# Altium project wificar.PrjPcb
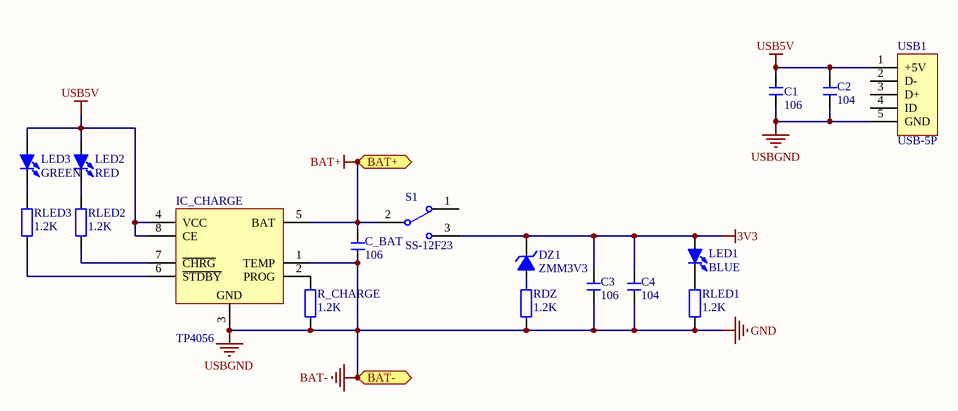
[diagram p0: Charge.SchDoc]
4 sheets, 33 parts. Net scope: flat (ports and power ports of the same name join across sheets).
Board file: SMARTWIFICAR.PcbDoc
Sheets:
  Charge.SchDoc
  Control.SchDoc
  Motor.SchDoc
  IO_CONN.SchDoc

## Sheet Charge.SchDoc
size A4

### Parts
C1  106  [C 0805_L]
C2  104  [C 0805_L]
C3  106  [C 0805_L]
C4  104  [C 0805_L]
C_BAT  106  [C 0805_L]
DZ1  ZMM3V3  [MINI_MELF (LL34)]
IC_CHARGE  TP4056  [SOP8_N]
LED1  BLUE  [LED 0805B]
LED2  RED  [LED 0805R]
LED3  GREEN  [LED 0805G]
R_CHARGE  1.2K  [R 0805_L]
RDZ  1.2K  [R 0805_L]
RLED1  1.2K  [R 0805_L]
RLED2  1.2K  [R 0805_L]
RLED3  1.2K  [R 0805_L]
S1  SS-12F23  [MSK-12C01-07]
USB1  USB-5P  [USB-MICRO_B]

### Ports
BAT+ (bidir), BAT- (bidir)

### Nets
3V3: C3.2 C4.2 DZ1.2(K) LED1.1(A) S1.3
BAT+: C_BAT.2 IC_CHARGE.5(BAT) S1.2 ; port BAT+
BAT-: C1.1 C2.1 C3.1 C4.1 C_BAT.1 IC_CHARGE.1(TEMP) IC_CHARGE.3(GND) R_CHARGE.1 RDZ.1 RLED1.1 USB1.5(GND) ; port BAT-  [also labelled GND, USBGND]
USB5V: C1.2 C2.2 IC_CHARGE.4(VCC) IC_CHARGE.8(CE) LED2.1(A) LED3.1(A) USB1.1(+5V)
NetDZ1_1: DZ1.1(A) RDZ.2
NetIC_CHARGE_2: IC_CHARGE.2(PROG) R_CHARGE.2
NetIC_CHARGE_6: IC_CHARGE.6(~{STDBY}) RLED3.1
NetIC_CHARGE_7: IC_CHARGE.7(~{CHRG}) RLED2.1
NetLED1_2: LED1.2(K) RLED1.2
NetLED2_2: LED2.2(K) RLED2.2
NetLED3_2: LED3.2(K) RLED3.2

Not connected (* = marked no-connect by the designer): S1 1; USB1 2(D-) 3(D+) 4(ID)

### Library data of the parts
C1-C4 C_BAT = C: 贴片电容; BOM名称: 无极性贴片电容; 淘宝ID: 封装库来自淘宝 ID：黄晶宝石; 联系售后，技术支持: https://shop463601444.taobao.com; 唯一出售店铺网址: https://shop463601444.taobao.com
DZ1 = 1N4619: 3V/0.5W稳压管; 版权归属: 封装库来自淘宝 ID：黄晶宝石; BOM名称: 3V/0.5W稳压管; 学习资源: www.ooocke.com
IC_CHARGE = TP4056: 锂电池充电管理; 淘宝ID: 封装库来自淘宝 ID：黄晶宝石; BOM名称: 锂电池充电管理; 技术支持，联系售后: https://shop463601444.taobao.com; 唯一出售店铺网址: https://shop463601444.taobao.com
LED1-LED3 = LED-SMD: 贴片LED; 版权归属: 封装库来自淘宝 ID：黄晶宝石; BOM名称: 贴片LED; 学习资源: https://shop463601444.taobao.com
R_CHARGE RDZ RLED1-RLED3 = R: 贴片电阻; 版权归属: 来自淘宝 ID：黄晶宝石; 封装库来自淘宝卖家 ID：黄晶宝石: 其他店铺购入均为盗版，不享受售后技术支持服务，请立即申请退款; BOM名称: 贴片电阻; 联系售后: https://shop463601444.taobao.com
S1 = SSW-1P: 1路波动开关; BOM名称: 波动开关; 版权归属: 封装库来自淘宝 ID：黄晶宝石; 学习资源: https://shop463601444.taobao.com
USB1 = USB-5P: 微型USB母座; BOM名称: 微型USB母座; 学习资源: https://shop463601444.taobao.com

## Sheet Control.SchDoc
size A4
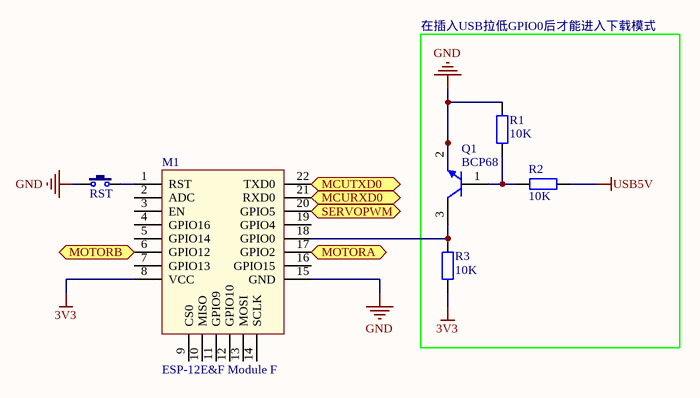
[diagram p1: Control.SchDoc]

### Parts
M1  ESP-12E&F Module F  [ESP-12E&F Module]
Q1  BCP68  [SOT-23]
R1  10K  [R 0805_L]
R2  10K  [R 0805_L]
R3  10K  [R 0805_L]
RST  3x6x5  [TSW SMD-3*6*2.5]  (value not drawn)

### Blocks framed on the sheet
在插入USB拉低GPIO0后才能进入下载模式: Q1 R1-R3

### Ports
MCURXD0 (bidir), MCUTXD0 (bidir), MOTORA (bidir), MOTORB (bidir), SERVOPWM (bidir)

### Nets
3V3: M1.8(VCC) R3.1
GND: M1.15(GND) Q1.2(E) R1.2 RST.1  [project net BAT-]
USB5V: R2.2
NetIC1_6: M1.17(GPIO2) ; port MOTORA
NetIC1_7: M1.6(GPIO12) ; port MOTORB
NetM1_1: M1.1(RST) RST.2
NetM1_18: M1.18(GPIO0) Q1.3(C) R3.2
NetM1_20: M1.20(GPIO5) ; port SERVOPWM
NetM1_21: M1.21(RXD0) ; port MCURXD0
NetM1_22: M1.22(TXD0) ; port MCUTXD0
NetQ1_1: Q1.1(B) R1.1 R2.1

Not connected (* = marked no-connect by the designer): M1 2(ADC) 3(EN) 4(GPIO16) 5(GPIO14) 7(GPIO13) 9(CS0) 10(MISO) 11(GPIO9) 12(GPIO10) 13(MOSI) 14(SCLK) 16(GPIO15) 19(GPIO4)

### Library data of the parts
M1 = ESP-12E&F Module
Q1 = BCP68: NPN三极管; Published: 17-Sep-2003; LatestRevisionDate: 12-Dec-2006; LatestRevisionNote: IPC-7351 Footprint Added.; DatasheetVersion: 8-Apr-1999; PackageVersion: Aug-2001; PackageReference: SOT223; Publisher: Altium Limited; PackageDescription: 4-Pin SOT-223 Package 2.3 mm Pitch, 7 mm Lead Span; ComponentLink1Description: Manufacturer Link; ComponentLink1URL: http://www.semiconductors.philips.com/; ComponentLink2Description: Datasheet; ComponentLink2URL: http://www.semiconductors.philips.com/acrobat/datasheets/BCP68_4.pdf
R1-R3 = R: as R_CHARGE on sheet Charge; BOM名称: 贴片电阻; 联系售后: https://shop463601444.taobao.com
RST = TSW 3x6: 3x6轻触开关; 版权归属: 封装库来自淘宝 ID：黄晶宝石; BOM名称: 3x6轻触开关; 学习资源: https://shop463601444.taobao.com

## Sheet Motor.SchDoc
size A4
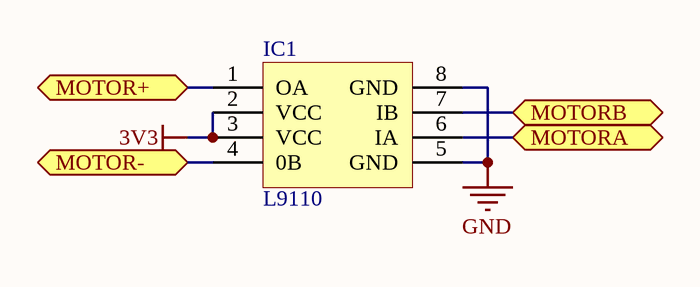
[diagram p2: Motor.SchDoc]

### Parts
IC1  L9110  [SOP8_N]

### Ports
MOTOR+ (bidir), MOTOR- (bidir), MOTORA (bidir), MOTORB (bidir)

### Nets
3V3: IC1.2(VCC) IC1.3(VCC)
GND: IC1.5(GND) IC1.8(GND)  [project net BAT-]
NetIC1_1: IC1.1(OA) ; port MOTOR+
NetIC1_4: IC1.4(0B) ; port MOTOR-
NetIC1_6: IC1.6(IA) ; port MOTORA
NetIC1_7: IC1.7(IB) ; port MOTORB

### Library data of the parts
IC1 = L9110: 直流电机控制芯片; 版权归属: 封装库来自淘宝 ID：黄晶宝石; BOM名称: 直流电机控制芯片; 学习资源: https://shop463601444.taobao.com

## Sheet IO_CONN.SchDoc
size A4
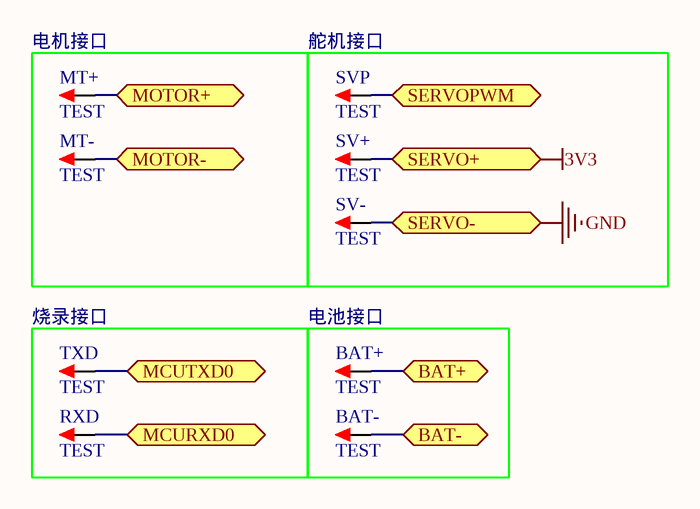
[diagram p3: IO_CONN.SchDoc]

### Parts
BAT+  TEST  [TEST 1.2]
BAT-  TEST  [TEST 1.2]
MT+  TEST  [TEST 1.2]
MT-  TEST  [TEST 1.2]
RXD  TEST  [TEST 1.2]
SV+  TEST  [TEST 1.2]
SV-  TEST  [TEST 1.2]
SVP  TEST  [TEST 1.2]
TXD  TEST  [TEST 1.2]

### Blocks framed on the sheet
舵机接口: SV+ SV- SVP
烧录接口: RXD TXD
电池接口: BAT+ BAT-

### Ports
BAT+ (bidir), BAT- (bidir), MCURXD0 (bidir), MCUTXD0 (bidir), MOTOR+ (bidir), MOTOR- (bidir), SERVO+ (bidir), SERVO- (bidir), SERVOPWM (bidir)

### Nets
3V3: SV+.1 ; port SERVO+
BAT+: BAT+.1 ; port BAT+
GND: BAT-.1 SV-.1 ; port SERVO-, port BAT-  [project net BAT-]
NetIC1_1: MT+.1 ; port MOTOR+
NetIC1_4: MT-.1 ; port MOTOR-
NetM1_20: SVP.1 ; port SERVOPWM
NetM1_21: RXD.1 ; port MCURXD0
NetM1_22: TXD.1 ; port MCUTXD0

### Notes on the sheet
- (near MT+) 电机接口

### Library data of the parts
BAT+ BAT- MT+ MT- RXD SV+ SV- SVP TXD = TEST: 测试点; 版权归属: 封装库来自淘宝 ID：黄晶宝石; BOM名称: 测试点; 学习资源: https://shop463601444.taobao.com

## Nets that join several sheets
3V3: Charge (5 pins), Control (M1.8 R3.1), Motor (IC1.2 IC1.3), IO_CONN (SV+.1)
BAT+: Charge (C_BAT.2 IC_CHARGE.5 S1.2), IO_CONN (BAT+.1)
BAT-: Charge (11 pins), Control (M1.15 Q1.2 R1.2 RST.1), Motor (IC1.5 IC1.8), IO_CONN (BAT-.1 SV-.1)
USB5V: Charge (7 pins), Control (R2.2)
NetIC1_1: Motor (IC1.1), IO_CONN (MT+.1)
NetIC1_4: Motor (IC1.4), IO_CONN (MT-.1)
NetIC1_6: Control (M1.17), Motor (IC1.6)
NetIC1_7: Control (M1.6), Motor (IC1.7)
NetM1_20: Control (M1.20), IO_CONN (SVP.1)
NetM1_21: Control (M1.21), IO_CONN (RXD.1)
NetM1_22: Control (M1.22), IO_CONN (TXD.1)